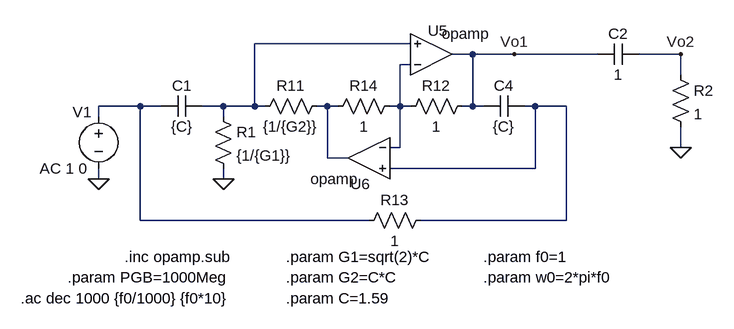
[diagram p0: schematic GIC_Alt_Bicuad.asc]
GIC_Alt_Bicuad.asc, the LTspice schematic file:
Version 4
SHEET 1 1652 680
WIRE 688 0 448 0
WIRE 784 16 752 16
WIRE 848 16 784 16
WIRE 976 16 848 16
WIRE 1104 16 1040 16
WIRE 688 32 672 32
WIRE 1104 48 1104 16
WIRE 272 96 208 96
WIRE 304 96 272 96
WIRE 400 96 368 96
WIRE 448 96 448 0
WIRE 448 96 400 96
WIRE 464 96 448 96
WIRE 560 96 544 96
WIRE 576 96 560 96
WIRE 672 96 672 32
WIRE 672 96 656 96
WIRE 688 96 672 96
WIRE 784 96 784 16
WIRE 784 96 768 96
WIRE 800 96 784 96
WIRE 880 96 864 96
WIRE 928 96 880 96
WIRE 208 112 208 96
WIRE 400 112 400 96
WIRE 672 160 672 96
WIRE 672 160 656 160
WIRE 1104 160 1104 128
WIRE 560 176 560 96
WIRE 592 176 560 176
WIRE 880 192 880 96
WIRE 880 192 656 192
WIRE 208 208 208 192
WIRE 400 208 400 192
WIRE 272 272 272 96
WIRE 624 272 272 272
WIRE 928 272 928 96
WIRE 928 272 704 272
FLAG 208 208 0
FLAG 400 208 0
FLAG 848 16 Vo1
FLAG 1104 160 0
FLAG 1104 16 Vo2
SYMBOL voltage 208 96 R0
WINDOW 123 -91 96 Left 2
WINDOW 39 0 0 Left 0
WINDOW 0 -40 9 Left 2
SYMATTR Value2 AC 1 0
SYMATTR InstName V1
SYMATTR Value ""
SYMBOL cap 368 80 R90
WINDOW 0 0 32 VBottom 2
WINDOW 3 32 32 VTop 2
SYMATTR InstName C1
SYMATTR Value {C}
SYMBOL Opamps\\opamp 720 80 M180
WINDOW 0 -5 100 Left 2
SYMATTR InstName U5
SYMBOL Opamps\\opamp 624 112 M0
WINDOW 0 -2 104 Left 2
SYMATTR InstName U6
SYMATTR SpiceLine2 GBW={PGB}
SYMBOL res 560 80 R90
WINDOW 0 0 56 VBottom 2
WINDOW 3 32 56 VTop 2
SYMATTR InstName R11
SYMATTR Value {1/{G2}}
SYMBOL res 784 80 R90
WINDOW 0 0 56 VBottom 2
WINDOW 3 32 56 VTop 2
SYMATTR InstName R12
SYMATTR Value 1
SYMBOL res 720 256 R90
WINDOW 0 0 56 VBottom 2
WINDOW 3 32 56 VTop 2
SYMATTR InstName R13
SYMATTR Value 1
SYMBOL cap 864 80 R90
WINDOW 0 0 32 VBottom 2
WINDOW 3 32 32 VTop 2
SYMATTR InstName C4
SYMATTR Value {C}
SYMBOL res 672 80 R90
WINDOW 0 0 56 VBottom 2
WINDOW 3 32 56 VTop 2
SYMATTR InstName R14
SYMATTR Value 1
SYMBOL res 384 96 R0
SYMATTR InstName R1
SYMATTR Value {1/{G1}}
SYMBOL res 1088 32 R0
SYMATTR InstName R2
SYMATTR Value 1
SYMBOL cap 1040 0 R90
WINDOW 0 0 32 VBottom 2
WINDOW 3 32 32 VTop 2
SYMATTR InstName C2
SYMATTR Value 1
TEXT 248 328 Left 2 !.inc opamp.sub
TEXT 88 392 Left 2 !.ac dec 1000 {f0/1000} {f0*10}
TEXT 496 328 Left 2 !.param G1=sqrt(2)*C
TEXT 496 360 Left 2 !.param G2=C*C
TEXT 800 360 Left 2 !.param w0=2*pi*f0
TEXT 800 328 Left 2 !.param f0=1
TEXT 160 360 Left 2 !.param PGB=1000Meg
TEXT 496 392 Left 2 !.param C=1.59

The netlist it stands for:
* GIC_Alt_Bicuad.asc
V1 N003 0 AC 1 0
C1 N001 N003 {C}
XU5 N002 N001 Vo1 opamp Aol=100K GBW=10Meg  ; pins invin noninvin out
XU6 N002 N005 N004 opamp Aol=100K GBW={PGB}  ; pins invin noninvin out
R11 N004 N001 {1/{G2}}
R12 Vo1 N002 1
R13 N005 N003 1
C4 N005 Vo1 {C}
R14 N002 N004 1
R1 N001 0 {1/{G1}}
R2 Vo2 0 1
C2 Vo2 Vo1 1
.inc opamp.sub
.ac dec 1000 {f0/1000} {f0*10}
.param G1=sqrt(2)*C
.param G2=C*C
.param w0=2*pi*f0
.param f0=1
.param PGB=1000Meg
.param C=1.59
.backanno
.end